# EAGLE schematic MLBSchematic2 (EAGLE 6.5.0)
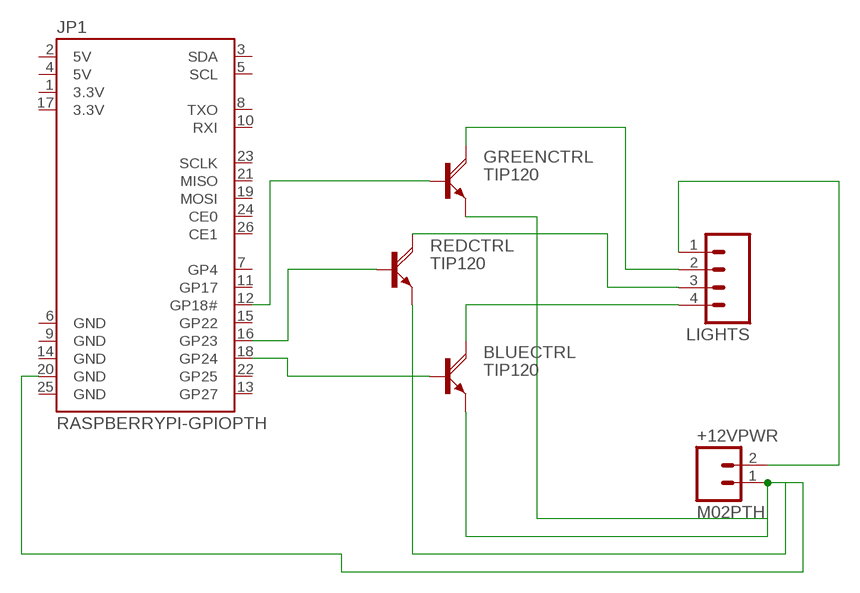
[diagram p0: schematic, sheet 1]

## Parts
+12VPWR  M02PTH  [1X02]
BLUECTRL  TIP120  [TO220AH]
GREENCTRL  TIP120  [TO220AH]
JP1  RASPBERRYPI-GPIOPTH  [2X13-SHROUDED]
LIGHTS  M04PTH  [1X04]
REDCTRL  TIP120  [TO220AH]

## Nets
N$1: GREENCTRL.C LIGHTS.2
N$2: LIGHTS.3 REDCTRL.C
N$3: BLUECTRL.C LIGHTS.4
N$4: GREENCTRL.B JP1.12(GP18#)
N$5: JP1.16(GP23) REDCTRL.B
N$6: BLUECTRL.B JP1.18(GP24)
N$8: +12VPWR.2 LIGHTS.1
N$10: +12VPWR.1 BLUECTRL.E GREENCTRL.E JP1.20(GND) REDCTRL.E
Unconnected: JP1.3(SDA) JP1.5(SCL) JP1.7(GP4) JP1.8(TXO) JP1.10(RXI) JP1.11(GP17) JP1.13(GP27) JP1.15(GP22) JP1.19(MOSI) JP1.21(MISO) JP1.22(GP25) JP1.23(SCLK) JP1.24(CE0) JP1.26(CE1)

## Power pins joined to a net without a drawn wire
3.3V: JP1.1(3.3V) JP1.17(3.3V)
5V: JP1.2(5V) JP1.4(5V)
GND: JP1.6(GND) JP1.9(GND) JP1.14(GND) JP1.25(GND)

## Library data of the parts
+12VPWR = SparkFun-Connectors:M02: Standard 2-pin 0.1" header. Use with - straight break away headers ( PRT-00116) - right angle break away headers (PRT-00553) - swiss pins (PRT-00743) - machine pins (PRT-00117) - female headers (PRT-00115) Molex polarized connector foot print use with: PRT-08233 with associated crimp pins and housings. 2.54_SCREWTERM for use with PRT-10571. 3.5mm Screw Terminal footprints for PRT-08084 5mm Screw Terminal footprints for use with PRT-08433
BLUECTRL GREENCTRL REDCTRL = transistor-power:TIP120: NPN DARLINGTON TRANSISTOR
JP1 = SparkFun-Boards:RASPBERRYPI-GPIO: RASPBERRY PI I/O HEADER As defined for the Revistion 2 Pi.; DIST: sparkfun; DIST_ID: PRT-11490
LIGHTS = SparkFun-Connectors:M04: Header 4 Standard 4-pin 0.1" header. Use with straight break away headers (SKU : PRT-00116), right angle break away headers (PRT-00553), swiss pins (PRT-00743), machine pins (PRT-00117), and female headers (PRT-00115). Molex polarized connector foot print use with SKU : PRT-08231 with associated crimp pins and housings. 1MM SMD Version SKU: PRT-10208